# EAGLE design CAMERA_MODULE (EAGLE 9.3.0)

## Sheet 1 of 6
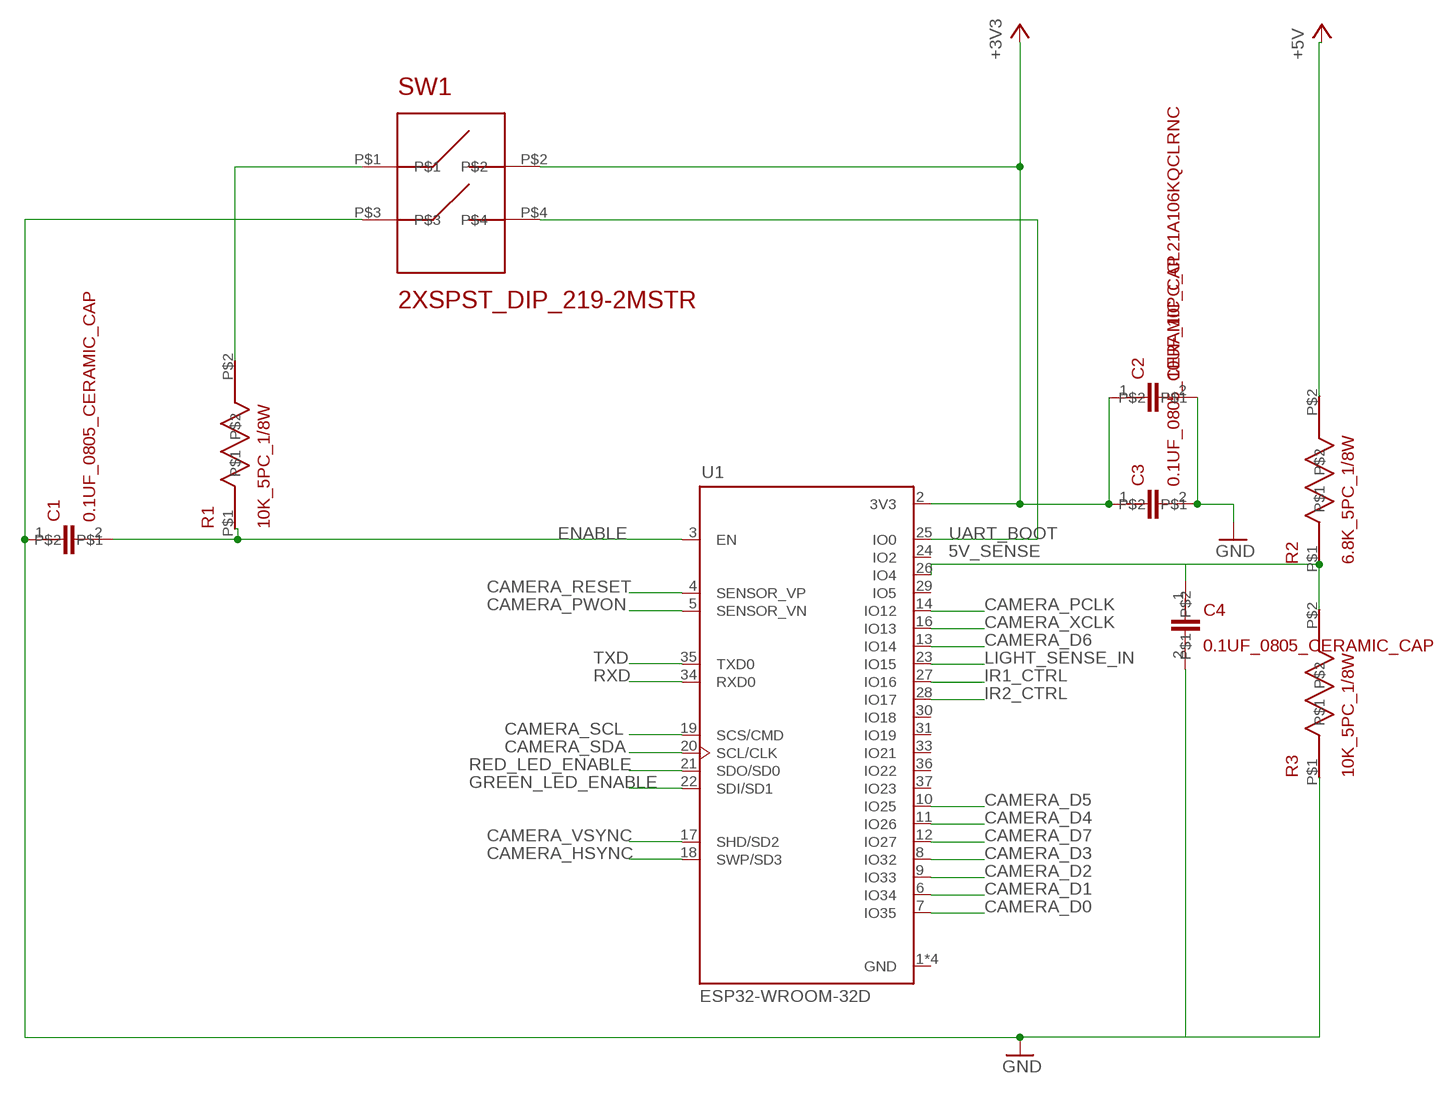
[diagram p0: schematic, sheet 1]

### Parts
C1  0.1UF_0805_CERAMIC_CAP  [C0805K]
C2  10UF_10PC_CL21A106KQCLRNC  [C0805K]
C3  0.1UF_0805_CERAMIC_CAP  [C0805K]
C4  0.1UF_0805_CERAMIC_CAP  [C0805K]
R1  10K_5PC_1/8W  [0805_1]
R2  6.8K_5PC_1/8W  [0805_1]
R3  10K_5PC_1/8W  [0805_1]
SW1  2XSPST_DIP_219-2MSTR  [2XSPST]
U1  ESP32-WROOM-32D  [MODULE_ESP32-WROOM-32D]

### Nets
5V_SENSE [Signal]: C4.1 R2.P$1 R3.P$2 U1.26(IO4)
+3V3: C2.1 C3.1 SW1.P$2 U1.2(3V3) ; also sheet 2,3,4
+5V: R2.P$2 ; also sheet 2,3,6
CAMERA_D0 [Signal]: U1.7(IO35) ; also sheet 2
CAMERA_D1 [Signal]: U1.6(IO34) ; also sheet 2
CAMERA_D2 [Signal]: U1.9(IO33) ; also sheet 2
CAMERA_D3 [Signal]: U1.8(IO32) ; also sheet 2
CAMERA_D4 [Signal]: U1.11(IO26) ; also sheet 2
CAMERA_D5 [Signal]: U1.10(IO25) ; also sheet 2
CAMERA_D6 [Signal]: U1.13(IO14) ; also sheet 2
CAMERA_D7 [Signal]: U1.12(IO27) ; also sheet 2
CAMERA_HSYNC: U1.18(SWP/SD3) ; also sheet 2
CAMERA_PCLK [Signal]: U1.14(IO12) ; also sheet 2
CAMERA_PWON [Signal]: U1.5(SENSOR_VN) ; also sheet 2
CAMERA_RESET [Signal]: U1.4(SENSOR_VP) ; also sheet 2
CAMERA_SCL [Signal]: U1.19(SCS/CMD) ; also sheet 2
CAMERA_SDA [Signal]: U1.20(SCL/CLK) ; also sheet 2
CAMERA_VSYNC [Signal]: U1.17(SHD/SD2) ; also sheet 2
CAMERA_XCLK [Signal]: U1.16(IO13) ; also sheet 2
ENABLE [Signal]: C1.2 R1.P$1 U1.3(EN)
GND: C1.1 C2.2 C3.2 C4.2 R3.P$1 SW1.P$3 ; also sheet 2,3,4,5,6
GREEN_LED_ENABLE: U1.22(SDI/SD1) ; also sheet 5
IR1_CTRL [Signal]: U1.27(IO16) ; also sheet 6
IR2_CTRL [Signal]: U1.28(IO17) ; also sheet 6
LIGHT_SENSE_IN [Signal]: U1.23(IO15) ; also sheet 4
N$2 [Signal]: R1.P$2 SW1.P$1
RED_LED_ENABLE [Signal]: U1.21(SDO/SD0) ; also sheet 5
RXD [Signal]: U1.34(RXD0) ; also sheet 2
TXD [Signal]: U1.35(TXD0) ; also sheet 2
UART_BOOT [Signal]: SW1.P$4 U1.25(IO0)
Unconnected: U1.24(IO2) U1.29(IO5) U1.30(IO18) U1.31(IO19) U1.33(IO21) U1.36(IO22) U1.37(IO23)

## Sheet 2 of 6
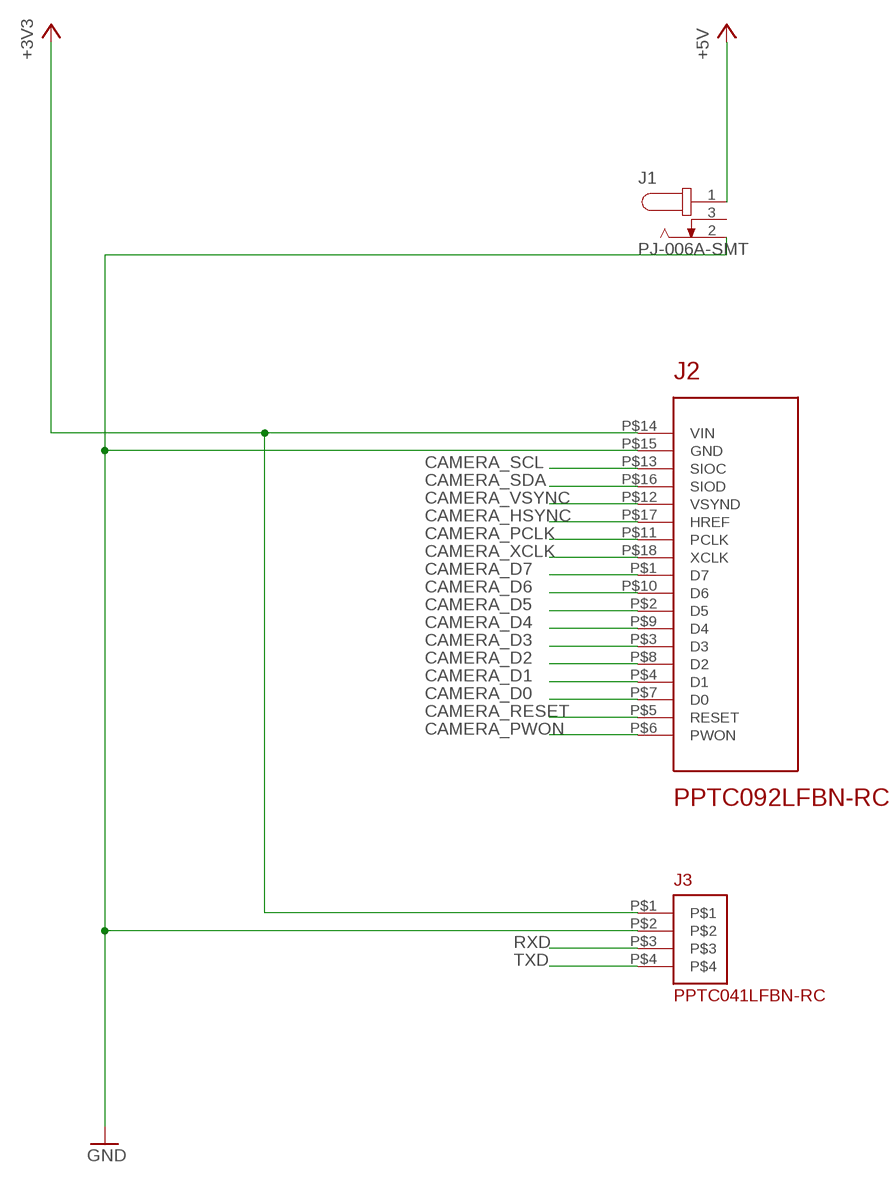
[diagram p1: schematic, sheet 2]

### Parts
J1  PJ-006A-SMT  [CUI_PJ-006A-SMT]
J2  PPTC092LFBN-RC  [2X9_0.1INCH]
J3  PPTC041LFBN-RC  [1X4_0.1INCH]

### Nets
+3V3: J2.P$14(VIN) J3.P$1 ; also sheet 1,3,4
+5V: J1.1 ; also sheet 1,3,6
CAMERA_D0 [Signal]: J2.P$7(D0) ; also sheet 1
CAMERA_D1 [Signal]: J2.P$4(D1) ; also sheet 1
CAMERA_D2 [Signal]: J2.P$8(D2) ; also sheet 1
CAMERA_D3 [Signal]: J2.P$3(D3) ; also sheet 1
CAMERA_D4 [Signal]: J2.P$9(D4) ; also sheet 1
CAMERA_D5 [Signal]: J2.P$2(D5) ; also sheet 1
CAMERA_D6 [Signal]: J2.P$10(D6) ; also sheet 1
CAMERA_D7 [Signal]: J2.P$1(D7) ; also sheet 1
CAMERA_HSYNC: J2.P$17(HREF) ; also sheet 1
CAMERA_PCLK [Signal]: J2.P$11(PCLK) ; also sheet 1
CAMERA_PWON [Signal]: J2.P$6(PWON) ; also sheet 1
CAMERA_RESET [Signal]: J2.P$5(RESET) ; also sheet 1
CAMERA_SCL [Signal]: J2.P$13(SIOC) ; also sheet 1
CAMERA_SDA [Signal]: J2.P$16(SIOD) ; also sheet 1
CAMERA_VSYNC [Signal]: J2.P$12(VSYND) ; also sheet 1
CAMERA_XCLK [Signal]: J2.P$18(XCLK) ; also sheet 1
GND: J1.2 J2.P$15(GND) J3.P$2 ; also sheet 1,3,4,5,6
RXD [Signal]: J3.P$3 ; also sheet 1
TXD [Signal]: J3.P$4 ; also sheet 1
Unconnected: J1.3

## Sheet 3 of 6
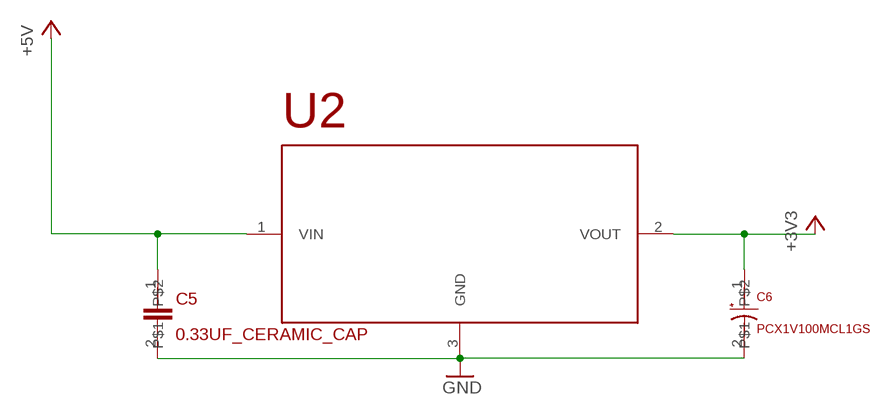
[diagram p2: schematic, sheet 3]

### Parts
C5  0.33UF_CERAMIC_CAP  [CAPC3216X110N]
C6  PCX1V100MCL1GS  [CAPAE660X600N]
U2  LD29150DT33R  [VREG_L7805CDT-TR]

### Nets
+3V3: C6.1 U2.2(VOUT) ; also sheet 1,2,4
+5V: C5.1 U2.1(VIN) ; also sheet 1,2,6
GND: C5.2 C6.2 U2.3(GND) ; also sheet 1,2,4,5,6

## Sheet 4 of 6
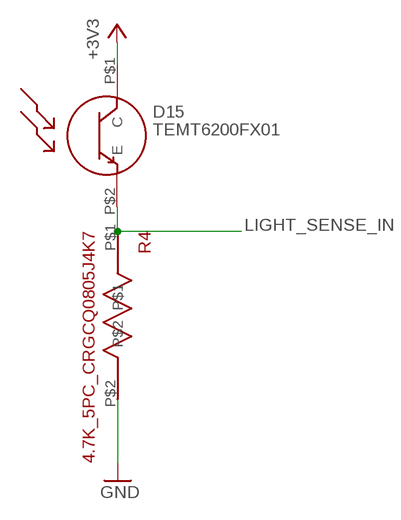
[diagram p3: schematic, sheet 4]

### Parts
D15  TEMT6200FX01  [TEMT6200FX01_0805]
R4  4.7K_5PC_CRGCQ0805J4K7  [0805_1]

### Nets
+3V3: D15.P$1(C) ; also sheet 1,2,3
GND: R4.P$2 ; also sheet 1,2,3,5,6
LIGHT_SENSE_IN [Signal]: D15.P$2(E) R4.P$1 ; also sheet 1

## Sheet 5 of 6
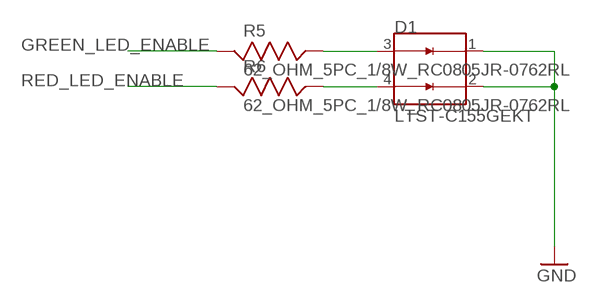
[diagram p4: schematic, sheet 5]

### Parts
D1  LTST-C155GEKT  [LED_LTST-C155GEKT]
R5  62_OHM_5PC_1/8W_RC0805JR-0762RL  [0805_1]
R6  62_OHM_5PC_1/8W_RC0805JR-0762RL  [0805_1]

### Nets
GND: D1.1 D1.2 ; also sheet 1,2,3,4,6
GREEN_LED_ENABLE: R5.P$1 ; also sheet 1
N$1 [Signal]: D1.3 R5.P$2
N$3 [Signal]: D1.4 R6.P$2
RED_LED_ENABLE [Signal]: R6.P$1 ; also sheet 1

## Sheet 6 of 6
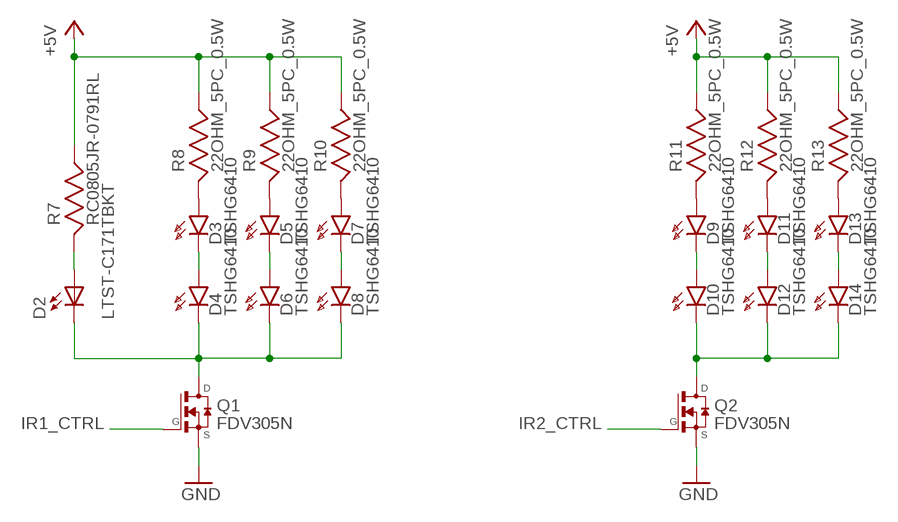
[diagram p5: schematic, sheet 6]

### Parts
D2  LTST-C171TBKT  [DIOC200X125X110]
D3  TSHG6410  [T1_LED_REAR_MOUNT]
D4  TSHG6410  [T1_LED_REAR_MOUNT]
D5  TSHG6410  [T1_LED_REAR_MOUNT]
D6  TSHG6410  [T1_LED_REAR_MOUNT]
D7  TSHG6410  [T1_LED_REAR_MOUNT]
D8  TSHG6410  [T1_LED_REAR_MOUNT]
D9  TSHG6410  [T1_LED_REAR_MOUNT]
D10  TSHG6410  [T1_LED_REAR_MOUNT]
D11  TSHG6410  [T1_LED_REAR_MOUNT]
D12  TSHG6410  [T1_LED_REAR_MOUNT]
D13  TSHG6410  [T1_LED_REAR_MOUNT]
D14  TSHG6410  [T1_LED_REAR_MOUNT]
Q1  FDV305N  [SOT23]
Q2  FDV305N  [SOT23]
R7  RC0805JR-0791RL  [RESC2012X60]
R8  22OHM_5PC_0.5W  [1206_RESISTOR]
R9  22OHM_5PC_0.5W  [1206_RESISTOR]
R10  22OHM_5PC_0.5W  [1206_RESISTOR]
R11  22OHM_5PC_0.5W  [1206_RESISTOR]
R12  22OHM_5PC_0.5W  [1206_RESISTOR]
R13  22OHM_5PC_0.5W  [1206_RESISTOR]

### Nets
+5V: R7.2 R8.P$2 R9.P$2 R10.P$2 R11.P$2 R12.P$2 R13.P$2 ; also sheet 1,2,3
GND: Q1.2(S) Q2.2(S) ; also sheet 1,2,3,4,5
IR1_CTRL [Signal]: Q1.1(G) ; also sheet 1
IR2_CTRL [Signal]: Q2.1(G) ; also sheet 1
N$4: D2.+ R7.1
N$5 [5V_0.75A_PWR]: D2.- D4.P$2(K) D6.P$2(K) D8.P$2(K) Q1.3(D)
N$6 [5V_0.75A_PWR]: D5.P$1(A) R9.P$1
N$7 [5V_0.75A_PWR]: D7.P$1(A) R10.P$1
N$8 [5V_0.75A_PWR]: D9.P$1(A) R11.P$1
N$9 [5V_0.75A_PWR]: D11.P$1(A) R12.P$1
N$10 [5V_0.75A_PWR]: D13.P$1(A) R13.P$1
N$11 [5V_0.75A_PWR]: D3.P$1(A) R8.P$1
N$12 [5V_0.75A_PWR]: D10.P$2(K) D12.P$2(K) D14.P$2(K) Q2.3(D)
N$13 [5V_0.75A_PWR]: D3.P$2(K) D4.P$1(A)
N$14: D5.P$2(K) D6.P$1(A)
N$15 [5V_0.75A_PWR]: D7.P$2(K) D8.P$1(A)
N$16 [5V_0.75A_PWR]: D9.P$2(K) D10.P$1(A)
N$17 [5V_0.75A_PWR]: D11.P$2(K) D12.P$1(A)
N$18 [5V_0.75A_PWR]: D13.P$2(K) D14.P$1(A)

## Power pins joined to a net without a drawn wire
GND: U1.1(GND) U1.15(GND) U1.38(GND) U1.39(GND)

## Library data of the parts
C1 C3 C4 = CAPC3216X110N:0.1UF_0805_CERAMIC_CAP
C2 = 0805_capacitors:10UF_10PC_CL21A106KQCLRNC
C5 = CAPC3216X110N:0.33UF_CERAMIC_CAP
C6 = CAPAE660X600N:PCX1V100MCL1GS
D1 = LTST-C155GEKT:LTST-C155GEKT: Green/Red 3.2 x 2.7 x 1.1 mm 130° Clear 6 / 2.5 mcd 2.1/2 V LED SMT; DESCRIPTION: Green/Red 3.2 x 2.7 x 1.1 mm 130° Clear 6 / 2.5 mcd 2.1/2 V LED SMT; DIGI-KEY_PART_NUMBER: 160-1172-1-ND; DIGI-KEY_PURCHASE_URL: https://www.digikey.com/product-detail/en/lite-on-inc/LTST-C155GEKT/160-1172-1-ND/269244?utm_source=snapeda&utm_medium=aggregator&utm_campaign=symbol; MF: Lite-On Inc.; MP: LTST-C155GEKT; PACKAGE: 1210 Lite-On
D2 = LTST-C171TBKT:LTST-C171TBKT: Green 2 x 1.25 x 1.1 mm 130° Water Clear 35 mcd 2 V Surface Mount LED; DESCRIPTION: Blue 2 x 1.25 x 0.8 mm 130° Water Clear 30 mcd 3.4 V LED SMT; DIGI-KEY_PART_NUMBER: 160-1645-1-ND; DIGI-KEY_PURCHASE_URL: https://www.digikey.com/product-detail/en/lite-on-inc/LTST-C171TBKT/160-1645-1-ND/573585?utm_source=snapeda&utm_medium=aggregator&utm_campaign=symbol; MF: Lite-On Inc.; MP: LTST-C171TBKT; PACKAGE: 0805 Lite-On
D3-D14 = T1_LED:TSHG6410
D15 = Phototransistor:TEMT6200FX01
J1 = PJ-006A-SMT:PJ-006A-SMT: 2.0 mm Center Pin, 2.5 A, Vertical, Surface Mount (SMT), Dc Power Jack Connector; CUI_PURCHASE_URL: https://www.cui.com/product/interconnect/dc-power-connectors/jacks/2.0-mm-center-pin/pj-006a-smt?utm_source=snapeda.com&utm_medium=referral&utm_campaign=snapedaBOM; DESCRIPTION: 18 VDC 4 A Unshielded Surface Mount 2 Conductors 3 Contacts Male Power Jack; DIGI-KEY_PART_NUMBER: CP-006APJCT-ND; DIGI-KEY_PURCHASE_URL: https://www.digikey.com/product-detail/en/cui-inc/PJ-006A-SMT-TR/CP-006APJCT-ND/669696?utm_source=snapeda&utm_medium=aggregator&utm_campaign=symbol; MF: CUI Inc.; MP: PJ-006A-SMT-TR; PACKAGE: None
J2 = Female_headers:PPTC092LFBN-RC
J3 = Female_headers:PPTC041LFBN-RC
Q1 Q2 = FDV305N:FDV305N: N-Channel MOSFET; DESCRIPTION: Fdv305n, 003, Plastic Molded, s Ot-23 Std-Pro Pkg1, Smd _49_<; DIGI-KEY_PART_NUMBER: FDV305NCT-ND; DIGI-KEY_PURCHASE_URL: https://www.digikey.com/product-detail/en/on-semiconductor/FDV305N/FDV305NCT-ND/1849927?utm_source=snapeda&utm_medium=aggregator&utm_campaign=symbol; MF: ON Semiconductor; MP: FDV305N; PACKAGE: SOT-23-3 ON Semiconductor
R1 R3 = 0805_resistors:10K_5PC_1/8W
R2 = 0805_resistors:6.8K_5PC_1/8W
R4 = 0805_resistors:4.7K_5PC_CRGCQ0805J4K7
R5 R6 = 0805_resistors:62_OHM_5PC_1/8W_RC0805JR-0762RL
R7 = RC0805JR-0791RL:RC0805JR-0791RL: RC Series 0805 0.125 W 2 kOhms 5% ±100 ppm/°C SMT Thick Film Chip Resistor; DESCRIPTION: Res Thick Film 2.0 x 1.2 mm 91 Ohm 5% 0.125W_1/8W_ 100ppm/ C Molded SMD Paper T/R; DIGI-KEY_PART_NUMBER: 311-91ARCT-ND; DIGI-KEY_PURCHASE_URL: https://www.digikey.com/product-detail/en/yageo/RC0805JR-0791RL/311-91ARCT-ND/731331?utm_source=snapeda&utm_medium=aggregator&utm_campaign=symbol; MF: Yageo; MP: RC0805JR-0791RL; PACKAGE: 0805 Yageo
R8-R13 = 1206_resistors:22OHM_5PC_0.5W
SW1 = DIP_Switches:2XSPST_DIP_219-2MSTR
U1 = ESP32-WROOM-32D:ESP32-WROOM-32D: IC: SoC; GPIO, I2C, I2S, IR, SD, SDIO, SPI, UART; 2.7÷3.6VDC; 20dBm; AVAILABILITY: Unavailable; DESCRIPTION: IC: SoC; GPIO, I2C, I2S, IR, SD, SDIO, SPI, UART; 2.7÷3.6VDC; 20dBm; MF: Espressif Systems; MP: ESP32-WROOM-32D; PACKAGE: Module Espressif Systems; PRICE: None
U2 = VREG_L7805CDT-TR:LD29150DT33R

## Net classes
0 default: clearance 0.254 mm
1 5V_3A_PWR: width 1.524 mm, clearance 0.381 mm
2 3V3_1.5A_PWR: width 1.27 mm, clearance 0.254 mm
3 Signal: width 0.254 mm, clearance 0.254 mm
4 5V_0.75A_PWR: width 0.254 mm, clearance 0.254 mm
5 5V_2.25A_PWR: width 0.762 mm, clearance 0.254 mm

## Board
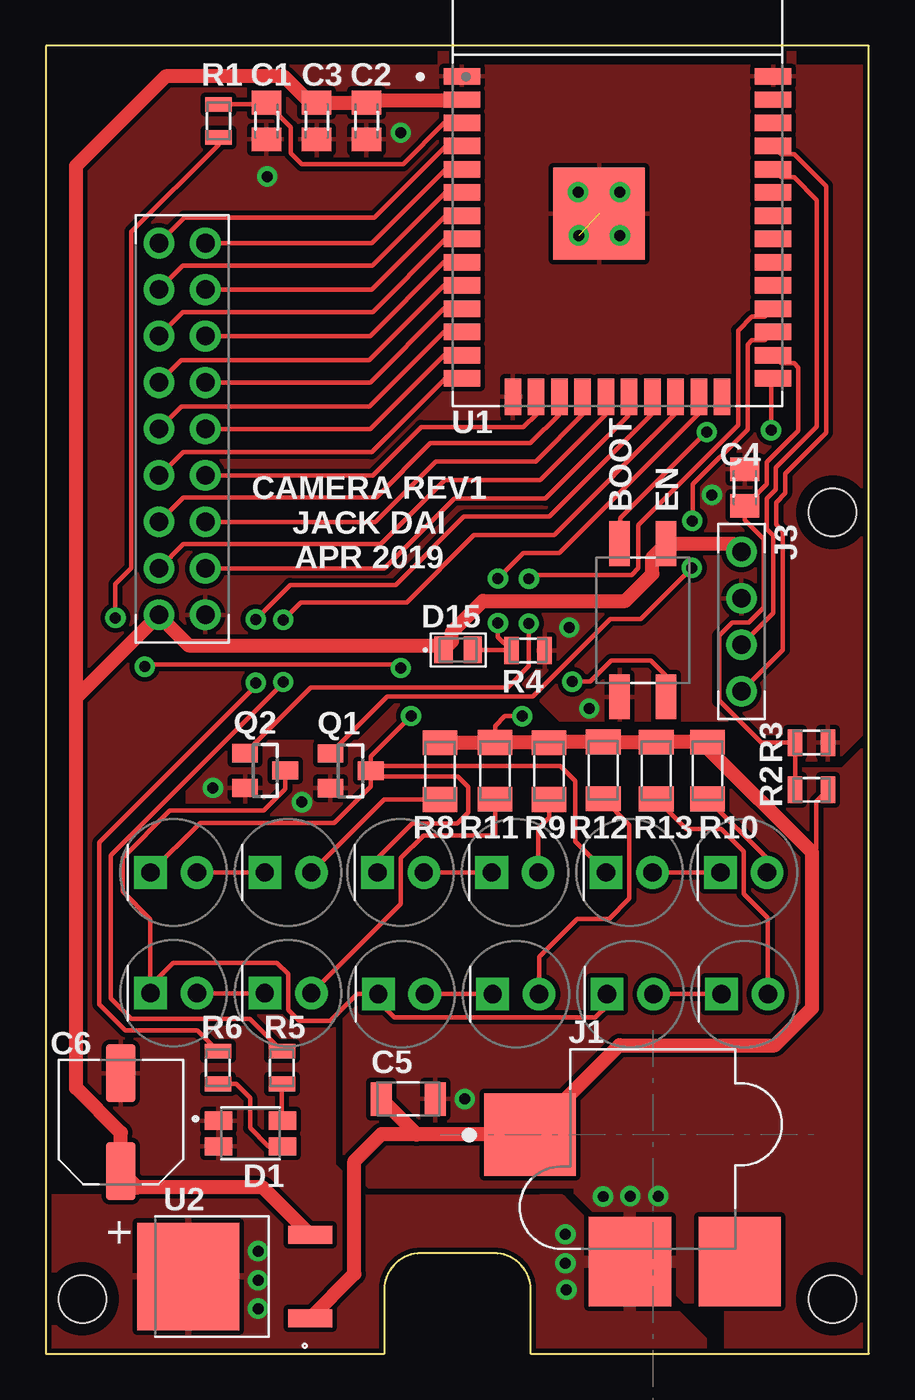
[diagram p6: board, top side]
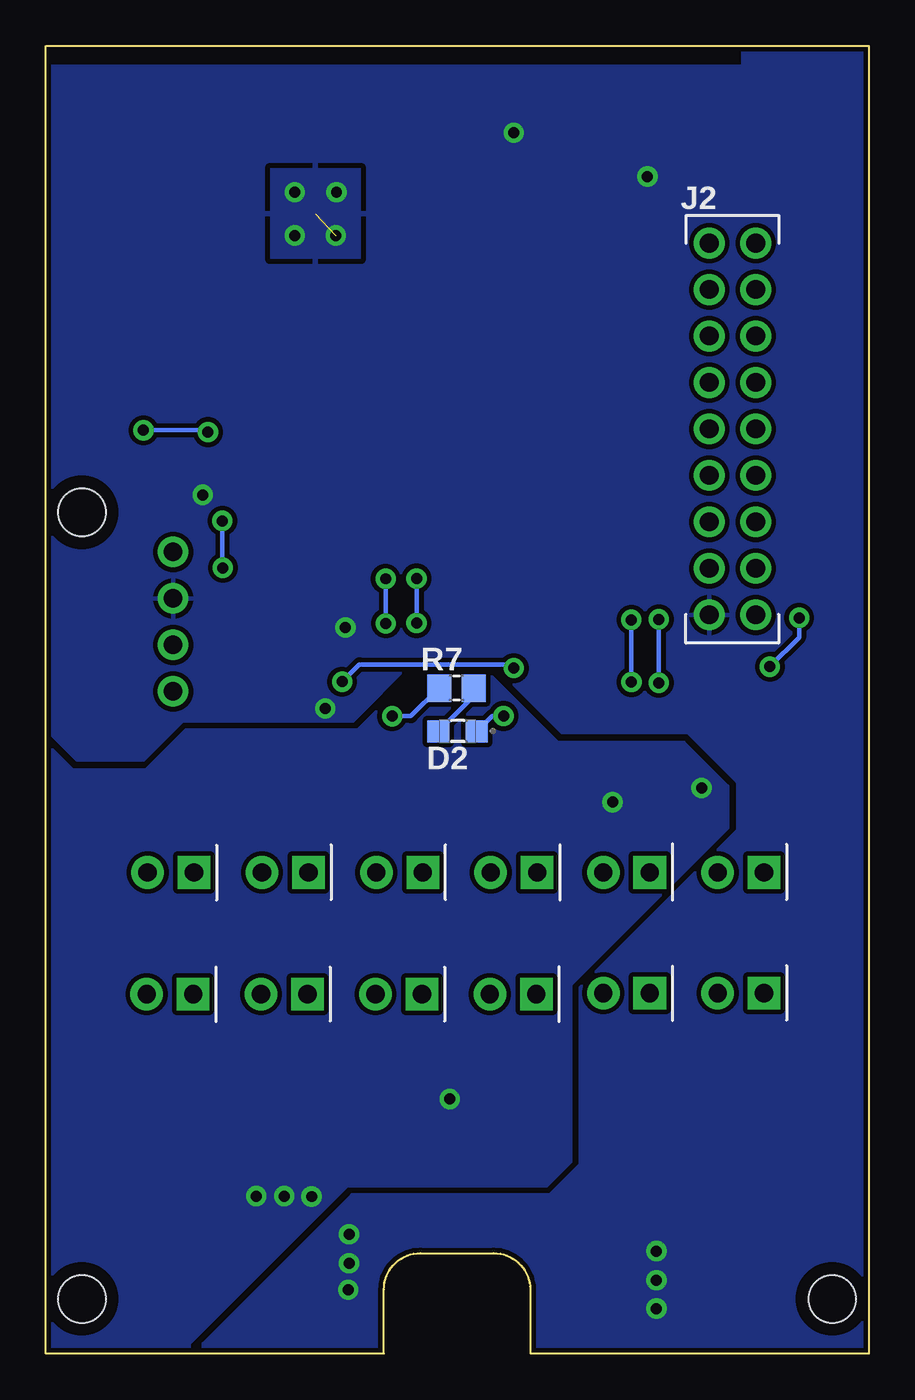
[diagram p7: board, bottom side, seen from below]

Size 44.97 x 71.5 mm. Coordinates in mm from the lower left corner, seen from the top.
Outline: 18.5,3.5 18.5,0 0,0 0,71.5 44.98,71.5 44.98,0 26.5,0 26.5,3.5 arc90 24.5,5.5 20.5,5.5 arc90 18.5,3.5
Copper layers (1*16): Top 0.035mm / dielectric 1.5mm / Bottom 0.035mm
Design rules "default *": minimum track width 10mil, minimum drill 0.6mm, track to track 10mil, track to pad 10mil, pad to pad 10mil, via to via 10mil, smd to smd 10mil, copper to edge 10mil, drill to drill 30mil, minimum pad ring 10mil, minimum via ring 10mil, stop-mask expansion 4mil, vias tented up to drill 0mil, thermal gap 10mil
Holes 2.6 mm at 43,46 43,3 2,3
tKeepout: area 1,2 to 3,4; area 42,2 to 44,4; area 42,45 to 44,47
bKeepout: area 42,45 to 44,47; area 42,2 to 44,4; area 1,2 to 3,4; area 7,70.5 to 21.2,71.5; area 22.2,70.5 to 40.2,71.5; area 41.2,70.5 to 45,71.5; area 32.8,60.4 to 33.1,64.3; area 28.2,64.8 to 32.2,65.2; area 28.2,59.5 to 32.2,59.8; area 27.4,60.4 to 27.7,64.3
tRestrict: area 42,45 to 44,47; area 42,2 to 44,4; area 1,2 to 3,4; area 7,70.5 to 21.4,71.5; area 41,70.5 to 45,71.5; area 22.1,70.5 to 40.5,71.5
bRestrict: area 7,70.5 to 45,71.5; area 1,2 to 3,4; area 42,2 to 44,4; area 42,45 to 44,47; area 27.7,64.8 to 30.1,65.1; area 30.4,64.8 to 32.7,65.1; area 32.7,62.5 to 33,64.8; area 32.7,59.8 to 33,62.2; area 30.4,59.6 to 32.7,59.8; area 27.7,59.6 to 30.1,59.8; area 27.5,59.8 to 27.7,62.2; area 27.5,62.5 to 27.7,64.8; 4 lines

### Footprints (pad centres in the part's own frame; a part is rotated, then mirrored left to right if it is on the bottom)
C0805K = smd 1.3 x 1.6: 1 -1,0; 2 1,0
CAPC3216X110N = smd 1.16 x 1.82: 1 -1.475,0; 2 1.475,0
CAPAE660X600N = smd 3.16 x 1.62: 1 -2.675,0; 2 2.675,0
LED_LTST-C155GEKT = smd 1.5 x 1: 1 -1.75,0.7; 2 -1.75,-0.7; 3 1.75,0.7; 4 1.75,-0.7
DIOC200X125X110 = smd 1.2 x 1.2: + 1.05,0; - -1.05,0
T1_LED_REAR_MOUNT = drill 1 pad 1.778: P$1 -1.27,0 | drill 1 pad 1.778 square: P$2 1.27,0
TEMT6200FX01_0805 = smd 1 x 1.45: P$1 -0.8,0; P$2 0.8,0
CUI_PJ-006A-SMT = smd 5 x 4.5: 1 0,0 | smd 4.5 x 4.9: 2 5.45,-6.95; 3 11.45,-6.95
2X9_0.1INCH = drill 1.016 pad 1.676: P$1 0,1.27; P$2 2.54,1.27; P$3 5.08,1.27; P$4 7.62,1.27; P$5 10.16,1.27; P$6 10.16,-1.27; P$7 7.62,-1.27; P$8 5.08,-1.27; P$9 2.54,-1.27; P$10 0,-1.27; P$11 -2.54,1.27; P$12 -5.08,1.27; P$13 -7.62,1.27; P$14 -10.16,1.27; P$15 -10.16,-1.27; P$16 -7.62,-1.27; P$17 -5.08,-1.27; P$18 -2.54,-1.27
1X4_0.1INCH = drill 1.016 pad 1.676: P$1 -3.81,0; P$2 -1.27,0; P$3 1.27,0; P$4 3.81,0
SOT23 = smd 1 x 1.4: 1 -0.95,-1.1; 2 0.95,-1.1; 3 0,1.1
0805_1 = smd 0.8 x 1.45: P$1 -0.9,0; P$2 0.9,0
RESC2012X60 = smd 1.3 x 1.5: 1 -0.95,0; 2 0.95,0
1206_RESISTOR = smd 1.35 x 1.9: P$1 -1.55,0; P$2 1.55,0
2XSPST = smd 1.118 x 2.438: P$1 -1.27,4.191; P$2 -1.27,-4.191; P$3 1.27,4.191; P$4 1.27,-4.191
MODULE_ESP32-WROOM-32D = smd 2 x 0.9: 1 -8.5,5.26; 2 -8.5,3.99; 3 -8.5,2.72; 4 -8.5,1.45; 5 -8.5,0.18; 6 -8.5,-1.09; 7 -8.5,-2.36; 8 -8.5,-3.63; 9 -8.5,-4.9; 10 -8.5,-6.17; 11 -8.5,-7.44; 12 -8.5,-8.71; 13 -8.5,-9.98; 14 -8.5,-11.25; 25 8.5,-11.25; 26 8.5,-9.98; 27 8.5,-8.71; 28 8.5,-7.44; 29 8.5,-6.17; 30 8.5,-4.9; 31 8.5,-3.63; 32 8.5,-2.36; 33 8.5,-1.09; 34 8.5,0.18; 35 8.5,1.45; 36 8.5,2.72; 37 8.5,3.99; 38 8.5,5.26 | smd 0.9 x 2: 15 -5.715,-12.25; 16 -4.445,-12.25; 17 -3.175,-12.25; 18 -1.905,-12.25; 19 -0.635,-12.25; 20 0.635,-12.25; 21 1.905,-12.25; 22 3.175,-12.25; 23 4.445,-12.25; 24 5.715,-12.25 | smd 5 x 5: 39 -1,-2.24
VREG_L7805CDT-TR = smd 0.98 x 2.4: 1 -2.28,-4.2; 2 2.28,-4.2 | smd 5.86 x 5.57: 3 0,2.47

### Placement (x,y rotation side)
C1  12.06,67.38 90 top
C2  17.53,67.38 270 top
C3  14.8,67.38 270 top
C4  38.2,47.35 90 top
C5  19.81,13.93 0 top
C6  4.1,12.66 90 top
D1  11.18,12.04 0 top
D2  22.47,34.03 180 bottom
D3  13.24,26.31 180 top
D4  6.99,26.31 180 top
D5  25.64,26.31 180 top
D6  19.39,26.31 180 top
D7  38.14,26.31 180 top
D8  31.89,26.31 180 top
D9  13.24,19.71 180 top
D10  6.99,19.71 180 top
D11  25.69,19.66 180 top
D12  19.44,19.66 180 top
D13  38.19,19.66 180 top
D14  31.94,19.66 180 top
D15  22.53,38.48 0 top
J1  26.47,11.99 0 top
J2  7.45,50.55 90 top
J3  38.01,40.02 270 top
Q1  16.66,31.87 270 top
Q2  11.99,31.88 270 top
R1  9.44,67.39 270 top
R2  41.85,30.83 0 top
R3  41.84,33.41 180 top
R4  26.36,38.44 0 top
R5  12.9,15.65 270 top
R6  9.4,15.65 270 top
R7  22.53,36.39 180 bottom
R8  21.55,31.85 90 top
R9  27.5,31.85 90 top
R10  36.16,31.88 90 top
R11  24.55,31.86 90 top
R12  30.46,31.89 90 top
R13  33.36,31.87 90 top
SW1  32.63,40.1 180 top
U1  31.24,64.56 0 top
U2  10.25,4.23 90 top

### Tracks (layer width: path | path; a pad name or v marks a point on that pad's centre or on a via)
5V_SENSE
  Top 0.254: U1.26 40.18,54.14 40.9,54.14 41.12,53.92 41.12,50.47 39.39,48.74 39.39,47.54 C4.1 38.2,45.56 39.23,44.53 39.23,40.78 38.42,39.97 37.51,39.97 36.79,39.26 36.79,35.7 39.09,33.41 R3.P$2 R2.P$1
+3V3
  Top 0.762: U2.2 11.86,9.09 4.99,9.09 C6.1 4.1,12.09 1.66,14.53 1.66,35.87 | 1.66,35.87 J2.P$14 6.18,40.35 7.81,38.72 21.49,38.72 D15.P$1 22.2,38.94 22.2,39.47 23.88,41.15 31.67,41.15 33.14,42.62 33.14,43.53 SW1.P$2 37.56,44.29 J3.P$1 | 1.66,35.87 1.66,64.94 6.54,69.83 13,69.83 14.45,68.38 C3.1 C2.1 17.63,68.48 22.67,68.48 U1.2
+5V  (via drill 0.6)
  Top 0.254: v26.04,34.85 25.09,34.85 24.55,34.31 R11.P$2 | 41.87,27.39 42.11,27.63 42.11,30.19 R2.P$2
  Top 0.762: U2.1 16.86,4.36 16.86,10.52 18.34,12 26.46,12 J1.1 | J1.1 31.35,16.87 39.84,16.87 41.87,18.9 41.87,27.39 36.16,33.11 R10.P$2 33.37,33.43 R13.P$2 30.48,33.42 R12.P$2 27.54,33.45 R9.P$2 R11.P$2 24.54,33.4 R8.P$2 | C5.1 20.27,11.99 J1.1
  Bottom 0.254: R7.2 25.02,34.85 v26.04,34.85
CAMERA_D0
  Top 0.254: J2.P$7 17.81,58.17 21.8,62.16 22.7,62.16 U1.7
CAMERA_D1
  Top 0.254: U1.6 22.7,63.43 21.8,63.43 17.85,59.49 7.49,59.49 J2.P$4
CAMERA_D2
  Top 0.254: U1.9 21.75,59.66 17.72,55.63 J2.P$8
CAMERA_D3
  Top 0.254: U1.8 22.7,60.89 21.8,60.89 17.86,56.95 7.49,56.95 J2.P$3
CAMERA_D4
  Top 0.254: U1.11 21.75,57.12 17.72,53.09 J2.P$9
CAMERA_D5
  Top 0.254: U1.10 21.76,58.39 17.68,54.31 7.4,54.31 J2.P$2
CAMERA_D6
  Top 0.254: J2.P$10 17.73,50.55 21.77,54.59 U1.13
CAMERA_D7
  Top 0.254: J2.P$1 7.4,51.77 17.68,51.77 21.76,55.85 U1.12
CAMERA_HSYNC
  Top 0.254: U1.18 29.4,52.24 29.4,51.41 26.77,48.78 21.3,48.78 18,45.47 J2.P$17
CAMERA_PCLK
  Top 0.254: J2.P$11 6.23,48.01 7.5,49.28 17.81,49.28 21.84,53.31 U1.14
CAMERA_PWON
  Top 0.254: U1.5 22.7,64.7 21.79,64.7 17.8,60.71 J2.P$6
CAMERA_RESET
  Top 0.254: J2.P$5 7.58,62.11 17.94,62.11 21.87,66.04 22.71,66.04 U1.4
CAMERA_SCL
  Top 0.254: J2.P$13 6.19,42.93 7.51,44.25 18.3,44.25 21.81,47.76 27.03,47.76 30.61,51.34 U1.19
CAMERA_SDA
  Top 0.254: U1.20 31.82,52.25 31.82,51.28 27.28,46.74 22.32,46.74 18.5,42.93 J2.P$16
CAMERA_VSYNC
  Top 0.254: J2.P$12 7.51,46.8 8.21,46.8 8.21,46.79 9.22,46.79 9.23,46.8 18.05,46.8 21.02,49.77 26.48,49.77 28.07,51.35 U1.17
CAMERA_XCLK
  Top 0.254: J2.P$18 17.87,48.01 20.51,50.66 26.1,50.66 26.82,51.37 26.8,51.39 U1.16
ENABLE
  Top 0.254: R1.P$1 11.97,68.29 C1.2 13.39,67.05 13.39,65.62 13.99,65.02 19.52,65.02 21.78,67.28 U1.3
GND  (via drill 0.6)  (1 unrouted)
  other vias: 31.37,63.5 29.13,61.13 31.37,61.13 9.14,30.92 14,30.15 19.4,66.75 29.7,35.28 28.6,39.7 12.1,64.35 36.4,46.95 33.47,8.62 22.89,13.92 11.6,5.61 11.6,4.01 11.6,2.47 31.94,8.61 30.45,8.59 29.09,63.5 28.4,6.53 28.4,4.95 28.45,3.5
  pour Top: 27.07,0.06 12.75,0.06 12.75,7.51 -0.08,7.51 -0.08,71.44 44.98,71.44 44.98,34.2 43.2,32.42 39.55,32.42 37.36,34.61 28.09,34.61 25.04,37.66 20.62,37.66 16.86,33.9 9.72,33.9 7.26,31.43 7.26,28.51 15.77,20 15.77,10.35 17.5,8.62 27.07,8.62
  pour Top: 36.47,0.06 28.14,8.39 27.07,8.39 27.07,0.06
  pour Top: 37.13,0.06 45.08,0.06 45.08,33.56 43.48,31.97 39.49,31.97 37.23,34.23 27.83,34.23 24.79,37.27 20.85,37.27 17.04,33.46 10.1,33.46 7.69,31.05 7.69,28.71 16.28,20.13 16.28,10.48 17.62,9.13 37.13,9.13
  pour Top: 29.05,9 37.61,0.44 37.61,9
  pour Top: 0,8.55 13.28,8.55 13.28,-0.01 0,-0.01
  pour Bottom: 36.4,-0.05 26.5,-0.05 26.5,4.45 25.4,5.55 19.5,5.55 18.3,4.35 18.3,-0.05 0,-0.05 0,71.45 45,71.45 45,34.15 43.3,32.45 39.6,32.45 37.45,34.6 28.15,34.6 25,37.75 20.6,37.75 16.8,33.95 9.93,33.95 7.2,31.22 7.2,28.62 15.8,20.02 15.8,10.35 17.45,8.7 28.25,8.7 36.4,0.55
  pour Bottom: 37.12,0.05 45,0.05 45,33.45 43.5,31.95 39.5,31.95 37.33,34.12 27.93,34.12 24.8,37.25 20.8,37.25 17,33.45 10.1,33.45 7.7,31.05 7.7,28.72 16.27,20.15 16.27,10.47 17.6,9.15 28.5,9.15 37.12,0.53
GREEN_LED_ENABLE  (via drill 0.6)
  Top 0.254: R5.P$1 11.14,18.31 4.67,18.31 3.56,19.43 3.56,27.25 12.97,36.67 v12.97,36.72 | U1.22 34.38,52.27 34.38,51.35 27.77,44.75 23.4,44.75 19.72,41.07 13.93,41.07 v12.98,40.12
  Bottom 0.254: v12.98,40.12 v12.98,36.72 v12.97,36.72
IR1_CTRL  (via drill 0.6)
  Top 0.254: Q1.1 18.66,35.92 26.61,35.92 30.86,40.17 32.51,40.17 v35.3,42.96 | U1.27 39.3,55.41 38.58,55.41 38.35,55.17 38.35,50.53 35.35,47.53 35.35,45.55 v35.33,45.53
  Bottom 0.254: v35.33,45.53 35.33,42.99 v35.3,42.96
IR2_CTRL  (via drill 0.6)
  Top 0.254: Q2.1 14.49,36.43 25.24,36.43 26.4,37.59 26.39,37.59 v26.39,39.92 | U1.28 39.3,56.68 38.58,56.68 37.84,55.94 37.84,50.76 32.38,45.31 32.38,42.94 32.01,42.57 26.61,42.57 v26.4,42.36
  Bottom 0.254: v26.39,39.92 v26.4,39.93 v26.4,42.36
LIGHT_SENSE_IN  (via drill 0.6)
  Top 0.254: D15.P$2 25.42,38.48 | 25.42,38.48 R4.P$1 | v24.71,39.94 24.71,39.19 25.42,38.48 | v24.71,42.38 26.09,43.76 28.06,43.76 35.69,51.39 U1.23
  Bottom 0.254: v24.71,42.38 v24.71,39.94
N$1
  Top 0.254: R5.P$2 12.9,12.77 D1.3
N$2  (via drill 0.6)
  Top 0.254: R1.P$2 9.44,66.1 4.68,61.34 4.68,42.95 3.81,42.08 v3.81,40.23 | v19.4,37.48 19.2,37.68 5.54,37.68 v5.41,37.55 | v28.77,36.74 29.75,36.74 30.9,37.89 33.06,37.89 33.9,37.05 SW1.P$1
  Bottom 0.254: v3.81,40.23 3.81,39.16 v5.41,37.55 | v19.4,37.48 19.61,37.68 27.83,37.68 v28.77,36.74
N$3
  Top 0.254: R6.P$2 10.42,14.75 11.16,14 11.16,12.34 12.16,11.34 D1.4
N$4
  Bottom 0.254: R7.1 21.58,35.96 D2.+
N$5  (via drill 0.6)
  Top 0.254: D4.P$2 8.43,29.02 15.77,29.02 17.76,31.01 Q1.3 | Q1.3 18.07,31.55 22.51,31.55 23.09,30.98 23.09,29.59 22.48,28.99 20.04,28.99 18.12,27.07 D6.P$2 | D8.P$2 28.92,28.01 28.92,31.3 28.1,32.12 18.01,32.12 Q1.3 | v19.96,34.86 17.76,32.66 Q1.3
  Bottom 0.254: v19.96,34.86 20.58,34.86 D2.-
N$6
  Top 0.254: R9.P$1 27.5,29.3 26.91,28.71 D5.P$1
N$7
  Top 0.254: R10.P$1 39.39,27.1 39.39,26.33 D7.P$1
N$8
  Top 0.254: R11.P$1 24.55,28.34 20.64,28.34 19.39,27.09 19.39,24.59 D9.P$1
N$9
  Top 0.254: D11.P$1 26.96,21.68 29.05,23.77 30.78,23.77 31.89,24.88 31.89,28.91 R12.P$1
N$10
  Top 0.254: D13.P$1 39.46,23.82 38.14,25.14 38.14,27.46 36.92,28.68 35.01,28.68 R13.P$1
N$11
  Top 0.254: R8.P$1 18.5,30.3 D3.P$1
N$12
  Top 0.254: D14.P$2 30.67,19.02 30.04,18.39 19.04,18.39 18.17,19.26 D12.P$2 17.02,19.66 15.54,18.19 13.86,18.19 13.24,18.8 13.24,20.76 12.64,21.36 6.97,21.36 5.72,20.11 D10.P$2 5.72,23.74 4.2,25.26 4.2,27.1 6.79,29.69 11.9,29.69 13.09,30.88 Q2.3
N$13
  Top 0.254: D4.P$1 D3.P$2
N$14
  Top 0.254: D6.P$1 D5.P$2
N$15
  Top 0.254: D8.P$1 D7.P$2
N$16
  Top 0.254: D10.P$1 D9.P$2
N$17
  Top 0.254: D12.P$1 D11.P$2
N$18
  Top 0.254: D14.P$1 D13.P$2
RED_LED_ENABLE  (via drill 0.6)
  Top 0.254: R6.P$1 8.27,17.68 4.34,17.68 2.93,19.09 2.93,27.96 11.48,36.51 v11.48,36.67 | U1.21 33.11,52.27 33.11,51.35 27.5,45.75 22.84,45.75 19.11,42.02 13.35,42.02 v11.48,40.14
  Bottom 0.254: v11.48,40.14 v11.48,36.68 v11.48,36.67
RXD
  Top 0.254: J3.P$3 39.75,40.49 39.75,44.73 39.4,45.08 39.4,46.75 39.9,47.25 39.9,48.43 42.14,50.67 42.14,63.06 40.9,64.3 40.18,64.3 U1.34
TXD
  Top 0.254: U1.35 40.18,65.57 40.9,65.57 42.64,63.82 42.64,50.36 40.41,48.12 40.41,47.04 39.91,46.54 39.91,45.32 40.27,44.95 40.27,38.47 J3.P$4
UART_BOOT  (via drill 0.6)
  Top 0.254: SW1.P$4 31.39,44.32 31.39,45.67 36.1,50.38 v36.11,50.38 | v39.64,50.48 39.64,53.2 U1.25
  Bottom 0.254: v39.64,50.48 36.21,50.48 v36.11,50.38

### Text on the board
tPlace: R1 | C1 | C3 | C2 | CAMERA REV1 / JACK DAI / APR 2019 | BOOT | EN | D15 | R4 | R3 | R2 | R8 | R11 | R9 | R12 | R13 | R10 | R6 | R5 | J1 | C5 | D1
bPlace: D2